# EAGLE design stylo_main (EAGLE 5.10)
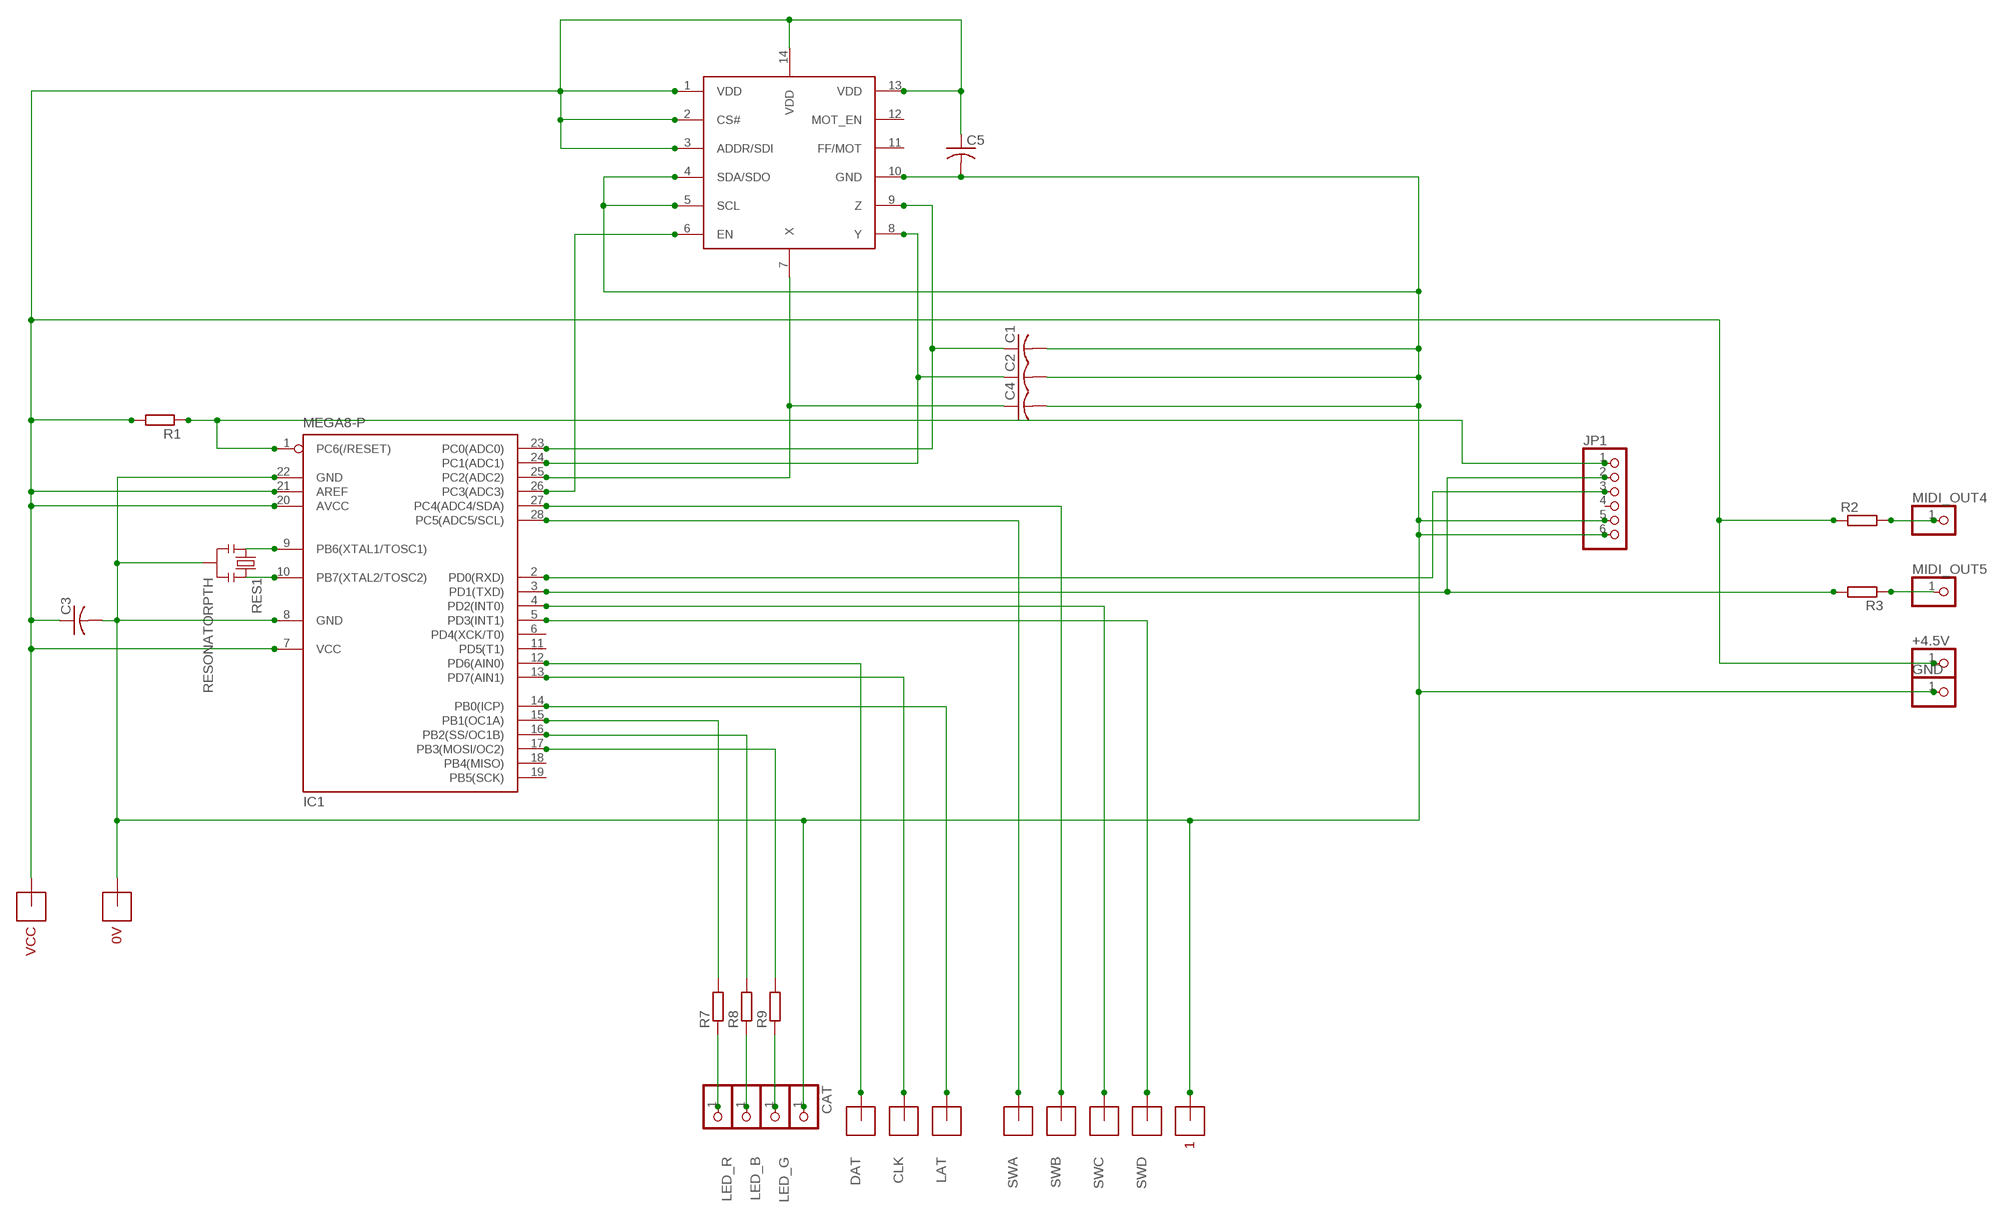
[diagram p0: schematic, sheet 1]

## Parts
0V  SMRIBBONCABLE  [SMRIBBONCABLE]
1  SMRIBBONCABLE  [SMRIBBONCABLE]
+4.5V  PINHD-1X1  [1X01]
C1  C-US025-024X044  [C025-024X044]
C2  C-US025-024X044  [C025-024X044]
C3  C-US025-024X044  [C025-024X044]
C4  C-US025-024X044  [C025-024X044]
C5  C-US025-024X044  [C025-024X044]
CAT  PINHD-1X1  [1X01]
CLK  SMRIBBONCABLE  [SMRIBBONCABLE]
DAT  SMRIBBONCABLE  [SMRIBBONCABLE]
GND  PINHD-1X1  [1X01]
IC1  MEGA8-P  [DIL28-3]
IC2  KXPS5  [LGA14]
JP1  PINHD-1X6  [1X06]
LAT  SMRIBBONCABLE  [SMRIBBONCABLE]
LED_B  PINHD-1X1  [1X01]
LED_G  PINHD-1X1  [1X01]
LED_R  PINHD-1X1  [1X01]
MIDI_OUT4  PINHD-1X1  [1X01]
MIDI_OUT5  PINHD-1X1  [1X01]
R1  R-EU_0207/2V  [0207/2V]
R2  R-EU_0207/2V  [0207/2V]
R3  R-EU_0207/2V  [0207/2V]
R7  R-EU_0204/7  [0204/7]
R8  R-EU_0204/7  [0204/7]
R9  R-EU_0204/7  [0204/7]
RES1  RESONATORPTH  [RESONATOR-PTH]
SWA  SMRIBBONCABLE  [SMRIBBONCABLE]
SWB  SMRIBBONCABLE  [SMRIBBONCABLE]
SWC  SMRIBBONCABLE  [SMRIBBONCABLE]
SWD  SMRIBBONCABLE  [SMRIBBONCABLE]
VCC  SMRIBBONCABLE  [SMRIBBONCABLE]

## Nets
GND: 0V.1 1.1 C1.2 C2.2 C3.2 C4.2 C5.2 CAT.1 GND.1 IC1.8(GND) IC1.22(GND) IC2.4(SDA/SDO) IC2.5(SCL) IC2.10(GND) JP1.5 JP1.6 RES1.2
N$1: MIDI_OUT5.1 R3.1
N$2: IC1.28(PC5(ADC5/SCL)) SWA.1
N$3: IC1.27(PC4(ADC4/SDA)) SWB.1
N$5: IC1.9(PB6(XTAL1/TOSC1)) RES1.1
N$6: IC1.10(PB7(XTAL2/TOSC2)) RES1.3
N$7: C4.1 IC1.25(PC2(ADC2)) IC2.7(X)
N$8: C2.1 IC1.24(PC1(ADC1)) IC2.8(Y)
N$9: C1.1 IC1.23(PC0(ADC0)) IC2.9(Z)
N$10: MIDI_OUT4.1 R2.2
N$12: IC1.4(PD2(INT0)) SWC.1
N$13: IC1.15(PB1(OC1A)) R7.2
N$14: IC1.14(PB0(ICP)) LAT.1
N$15: IC1.16(PB2(SS/OC1B)) R8.2
N$16: IC1.1(PC6(/RESET)) JP1.1 R1.1
N$19: IC1.17(PB3(MOSI/OC2)) R9.2
N$20: DAT.1 IC1.12(PD6(AIN0))
N$22: CLK.1 IC1.13(PD7(AIN1))
N$24: IC1.26(PC3(ADC3)) IC2.6(EN)
N$25: IC1.5(PD3(INT1)) SWD.1
N$35: LED_R.1 R7.1
N$36: LED_B.1 R8.1
N$37: LED_G.1 R9.1
RX: IC1.2(PD0(RXD)) JP1.3
TX: IC1.3(PD1(TXD)) JP1.2 R3.2
VCC: +4.5V.1 C3.1 C5.1 IC1.7(VCC) IC1.20(AVCC) IC1.21(AREF) IC2.1(VDD) IC2.2(CS#) IC2.3(ADDR/SDI) IC2.13(VDD) IC2.14(VDD) R1.2 R2.1 VCC.1
Unconnected: IC1.6(PD4(XCK/T0)) IC1.11(PD5(T1)) IC1.18(PB4(MISO)) IC1.19(PB5(SCK)) IC2.11(FF/MOT) IC2.12(MOT_EN) JP1.4

## Library data of the parts
0V 1 CLK DAT LAT SWA SWB SWC SWD VCC = jasons_stuff:SMRIBBONCABLE
+4.5V CAT GND LED_B LED_G LED_R MIDI_OUT4 MIDI_OUT5 = adafruit:PINHD-1X1: Pin header 1x1 for 0.1" spacing With round pins
C1-C5 = adafruit:C-US: CAPACITOR, American symbol
IC1 = atmel:MEGA8-P: MICROCONTROLLER 8 Kbytes FLASH, 1 kbytes SRAM, 512 bytes EEPROM, USART, 4-channel 10 bit ADC, 2-channel 8 bit ADC Pin compatible with Atmega48, ATMega88, ATMega168 Source: avr.lbr
IC2 = jasons_stuff:KXPS5
JP1 = pinhead:PINHD-1X6: PIN HEADER
R1-R3 R7-R9 = rcl:R-EU_: RESISTOR, European symbol
RES1 = SparkFun:RESONATOR: Resonator Small SMD resonator. This is the itty bitty 10/20MHz resonators with built in caps. CSTCE10M0G55 and CSTCE20M0V53. Footprint has been reviewed closely but hasn't been tested yet.

## Board
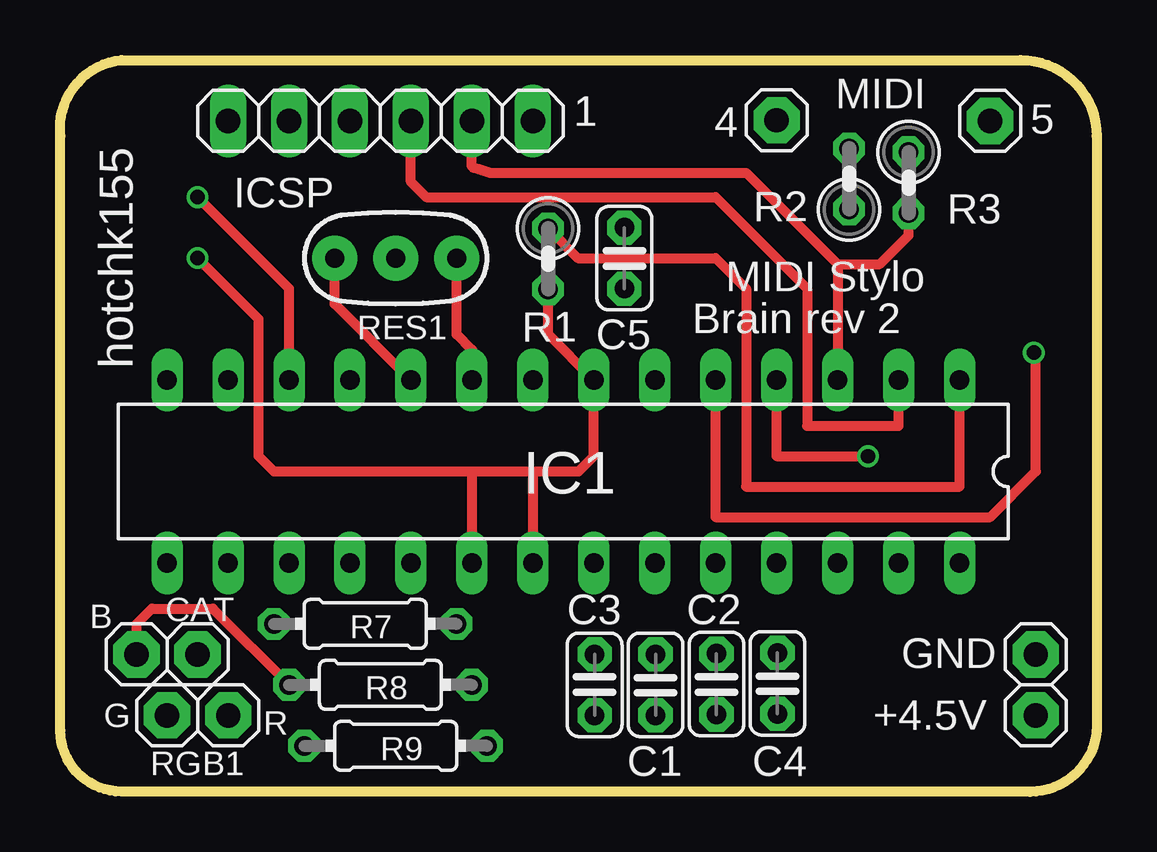
[diagram p1: board, top side]
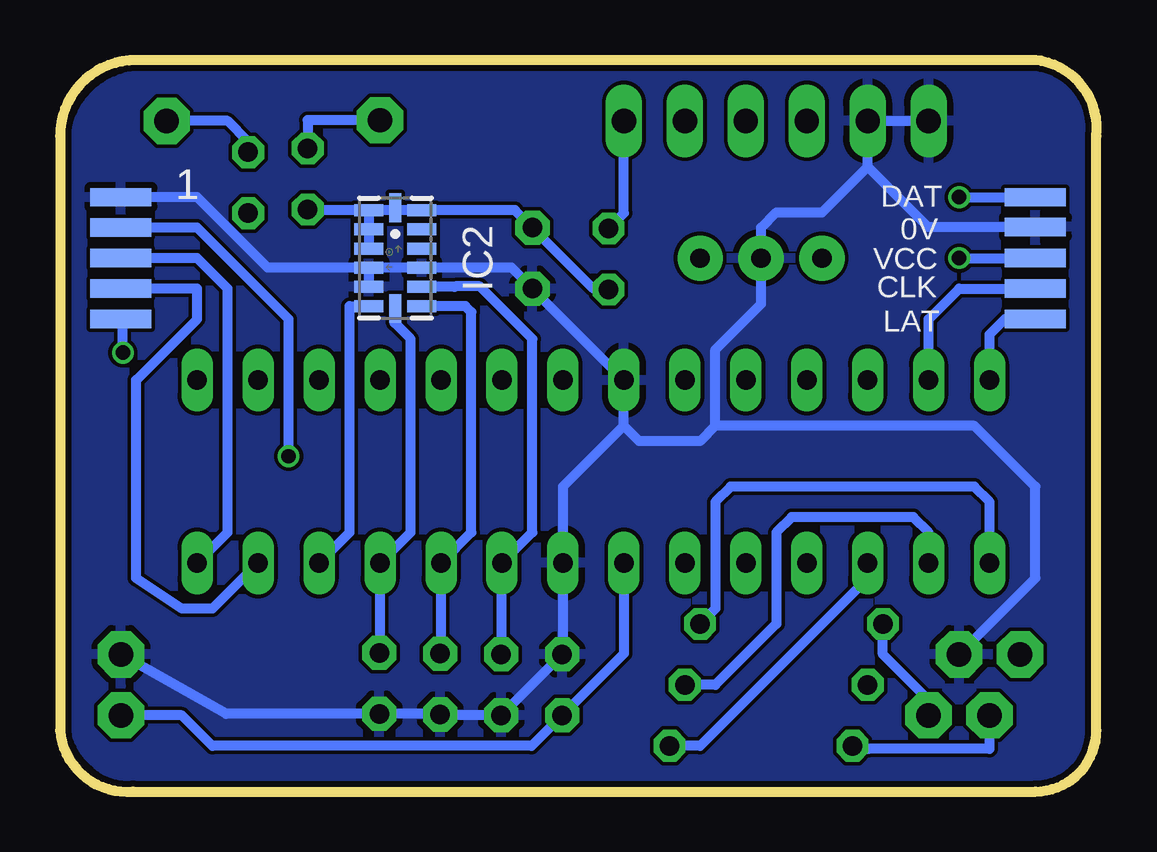
[diagram p2: board, bottom side, seen from below]

Size 43.2 x 30.49 mm. Coordinates in mm from the lower left corner, seen from the top.
Outline: 0.02,27.32 arc-90 2.56,30.49 40.02,30.49 arc-90 43.2,27.32 43.2,2.55 arc-90 40.15,0.01 2.56,0.01 arc-90 0.02,2.55 0.02,27.32
Copper layers (1*16): Top 0.035mm / dielectric 1.5mm / Bottom 0.035mm
Design rules "ITEADstudio_DRC": minimum track width 6mil, minimum drill 12mil, track to track 6mil, track to pad 6mil, pad to pad 6mil, via to via 6mil, smd to smd 0mil, copper to edge 10mil, drill to drill 10mil, minimum pad ring 10mil, minimum via ring 6mil, stop-mask expansion 2mil, vias tented up to drill 100mil, thermal gap 10mil

### Footprints (pad centres in the part's own frame; a part is rotated, then mirrored left to right if it is on the bottom)
SMRIBBONCABLE = smd 2.54 x 0.762: 1 0,0
1X01 = drill 1.016 pad 1.93 octagon: 1 0,0
C025-024X044 = drill 0.813 pad 1.422 octagon: 1 -1.27,0; 2 1.27,0
DIL28-3 = drill 0.813 long: 1 -16.51,-3.81; 2 -13.97,-3.81; 3 -11.43,-3.81; 4 -8.89,-3.81; 5 -6.35,-3.81; 6 -3.81,-3.81; 7 -1.27,-3.81; 8 1.27,-3.81; 9 3.81,-3.81; 10 6.35,-3.81; 11 8.89,-3.81; 12 11.43,-3.81; 13 13.97,-3.81; 14 16.51,-3.81; 15 16.51,3.81; 16 13.97,3.81; 17 11.43,3.81; 18 8.89,3.81; 19 6.35,3.81; 20 3.81,3.81; 21 1.27,3.81; 22 -1.27,3.81; 23 -3.81,3.81; 24 -6.35,3.81; 25 -8.89,3.81; 26 -11.43,3.81; 27 -13.97,3.81; 28 -16.51,3.81
LGA14 = smd 0.5 x 1.2: 1 2,1.1; 2 1.2,1.1; 3 0.4,1.1; 4 -0.4,1.1; 5 -1.2,1.1; 6 -2,1.1; 8 -2,-1.1; 9 -1.2,-1.1; 10 -0.4,-1.1; 11 0.4,-1.1; 12 1.2,-1.1; 13 2,-1.1 | smd 1.2 x 0.5: 7 -2.1,0; 14 2.1,0
1X06 = drill 1.016 long: 1 -6.35,0; 2 -3.81,0; 3 -1.27,0; 4 1.27,0; 5 3.81,0; 6 6.35,0
0207/2V = drill 0.813 octagon: 1 -1.27,0; 2 1.27,0
0204/7 = drill 0.813 octagon: 1 -3.81,0; 2 3.81,0
RESONATOR-PTH = drill 0.8 pad 1.88 round: 1 -2.54,0; 2 0,0; 3 2.54,0

### Placement (x,y rotation side)
0V  2.56,23.54 0 bottom
1  40.66,24.78 0 bottom
+4.5V  40.66,3.19 0 top
C1  24.81,4.46 270 top
C2  27.35,4.49 270 top
C3  22.27,4.46 90 top
C4  29.89,4.52 270 top
C5  23.51,22.24 270 top
CAT  5.73,5.73 0 top
CLK  2.56,20.97 0 bottom
DAT  2.56,24.78 0 bottom
GND  40.66,5.73 0 top
IC1  20.97,13.35 180 top
IC2  29.23,22.24 90 bottom
JP1  13.35,27.95 180 top
LAT  2.56,19.7 0 bottom
LED_B  3.19,5.73 0 top
LED_G  4.46,3.19 0 top
LED_R  7.01,3.19 0 top
MIDI_OUT4  29.86,27.98 0 top
MIDI_OUT5  38.75,27.95 0 top
R1  20.34,22.2 270 top
R2  32.88,25.54 90 top
R3  35.35,25.38 270 top
R7  12.72,7 0 top
R8  13.35,4.46 0 top
R9  13.99,1.92 0 top
RES1  13.99,22.24 180 top
SWA  40.66,22.24 0 bottom
SWB  40.66,20.97 0 bottom
SWC  40.66,23.51 0 bottom
SWD  40.66,19.7 0 bottom
VCC  2.56,22.24 0 bottom

### Tracks (layer width: path | path; a pad name or v marks a point on that pad's centre or on a via)
GND
  Bottom 0.406: IC2.4 IC2.10 24.38,21.84 C5.2 | IC2.4 IC2.5 | C5.2 | C5.2 IC1.8 19.7,15.25 | IC2.4 34.54,21.84 37.48,24.78 39.39,24.78 1.1 | 15.89,15.25 15.89,18.43 13.99,20.33 RES1.2 13.99,23.51 13.35,24.14 11.45,24.14 9.54,26.05 | 15.89,15.25 16.53,14.62 19.07,14.62 19.7,15.25 | 19.7,15.25 22.24,12.71 IC1.22 22.24,5.76 C3.2 | C3.2 | C3.2 C1.2 27.32,3.19 C2.2 27.39,3.25 C4.2 36.28,3.25 GND.1 | 15.89,15.25 5.1,15.25 2.56,12.71 2.56,8.9 CAT.1 | 0V.1 7.03,23.54 9.54,26.05 | 9.54,26.05 JP1.5 JP1.6
  pour Bottom: 2.56,29.86 39.39,29.86 arc-90 42.56,27.32 42.56,2.55 arc-90 39.39,0.65 2.56,0.65 arc-90 0.65,2.55 0.65,27.32 arc-90
N$1
  Bottom 0.406: R3.1 35.36,27.09 36.21,27.95 MIDI_OUT5.1 | MIDI_OUT5.1
N$2
  Bottom 0.406: SWA.1 37.48,22.24 36.21,20.97 36.21,10.81 IC1.28
N$3
  Bottom 0.406: IC1.27 36.85,7.63 38.12,7.63 40.02,8.9 40.02,17.16 37.48,19.7 37.48,20.97 SWB.1
N$5
  Top 0.406: RES1.1 16.53,19.06 17.16,18.43 IC1.9
N$6
  Top 0.406: RES1.3 11.45,20.33 IC1.10
N$7
  Bottom 0.406: C4.1 29.86,5.82 IC1.25 28.59,10.81 28.59,18.87 29.26,19.54 29.26,20.1 IC2.7
N$8
  Bottom 0.406: C2.1 27.32,5.79 IC1.24 26.05,10.81 26.05,19.98 26.31,20.24 IC2.8
N$9
  Bottom 0.406: IC2.9 26.76,21.04 26.73,21.06 25.7,21.06 23.51,18.87 23.51,10.81 IC1.23 24.78,5.76 C1.1
N$10
  Bottom 0.406: MIDI_OUT4.1 32.88,27.98 R2.2
N$12  (via drill 0.6)
  Top 0.406: v33.67,13.98 29.86,13.98 IC1.4
  Bottom 0.406: SWC.1 37.48,23.51 33.67,19.7 v33.67,13.98
N$13
  Bottom 0.406: IC1.15 4.46,12.08 5.1,12.71 15.26,12.71 15.89,12.08 15.89,7.63 R7.2
N$14
  Bottom 0.406: LAT.1 3.83,19.7 4.46,19.06 IC1.14
N$15
  Bottom 0.406: IC1.16 7,10.81 7.64,11.44 12.72,11.44 13.35,10.81 13.35,7 15.89,4.46 R8.2
N$16
  Top 0.406: IC1.1 37.48,12.71 28.59,12.71 28.59,20.97 27.32,22.24 21.58,22.24 R1.1
  Bottom 0.406: JP1.1 19.7,24.11 R1.1
N$19
  Bottom 0.406: IC1.17 9.54,8.9 16.53,1.92 R9.2
N$20  (via drill 0.6)
  Top 0.406: IC1.12 9.54,20.97 v5.73,24.78
  Bottom 0.406: v5.73,24.78 DAT.1
N$22
  Bottom 0.406: CLK.1 5.73,20.97 7,19.7 IC1.13
N$24
  Bottom 0.406: IC1.26 31.13,10.81 31.13,20.24 30.88,20.24 IC2.6
N$25  (via drill 0.6)
  Top 0.406: IC1.5 27.32,11.44 38.75,11.44 40.66,13.35 40.66,18.22 v40.58,18.3
  Bottom 0.406: v40.58,18.3 40.58,19.62 40.02,19.7 SWD.1 | SWD.1
N$35
  Bottom 0.406: R7.1 8.91,5.73 7,3.82 LED_R.1
N$36
  Top 0.406: LED_B.1 3.19,7 3.83,7.63 6.37,7.63 R8.1
N$37
  Bottom 0.406: R9.1 9.51,1.79 4.46,1.79 LED_G.1
RX
  Top 0.406: IC1.2 34.94,15.25 31.13,15.25 31.13,20.97 27.32,24.78 15.26,24.78 14.62,25.41 JP1.3
TX
  Top 0.406: JP1.2 17.16,26.05 17.96,25.79 28.59,25.79 32.4,21.98 | 32.4,21.98 IC1.3 | 32.4,21.98 34.15,21.98 35.36,23.19 R3.2 | R3.2
VCC  (via drill 0.6)
  Top 0.406: R1.2 20.34,19.06 IC1.7 22.24,13.98 21.61,13.35 19.7,13.35 | v5.73,22.24 8.27,19.7 8.27,13.98 8.91,13.35 17.16,13.35 | 17.16,13.35 19.7,13.35 | 17.16,13.35 IC1.20 | 19.7,13.35 IC1.21
  Bottom 0.406: IC2.1 29.33,24.24 IC2.14 29.13,24.24 IC2.13 24.24,24.24 C5.1 | IC2.1 IC2.2 IC2.3 | C5.1 | C5.1 20.97,20.97 20.37,20.97 R1.2 | v5.73,22.24 VCC.1 | +4.5V.1 38.12,3.19 36.85,1.92 23.54,1.92 C3.1 19.7,5.76 IC1.21 | IC2.1 32.88,24.24 R2.1

### Text on the board
tNames: 1 | MIDI | 4 | 5 | ICSP | MIDI Stylo | RES1 | Brain rev 2 | hotchk155 | B | CAT | G | RGB1 | R
bValues: keypad | buttons